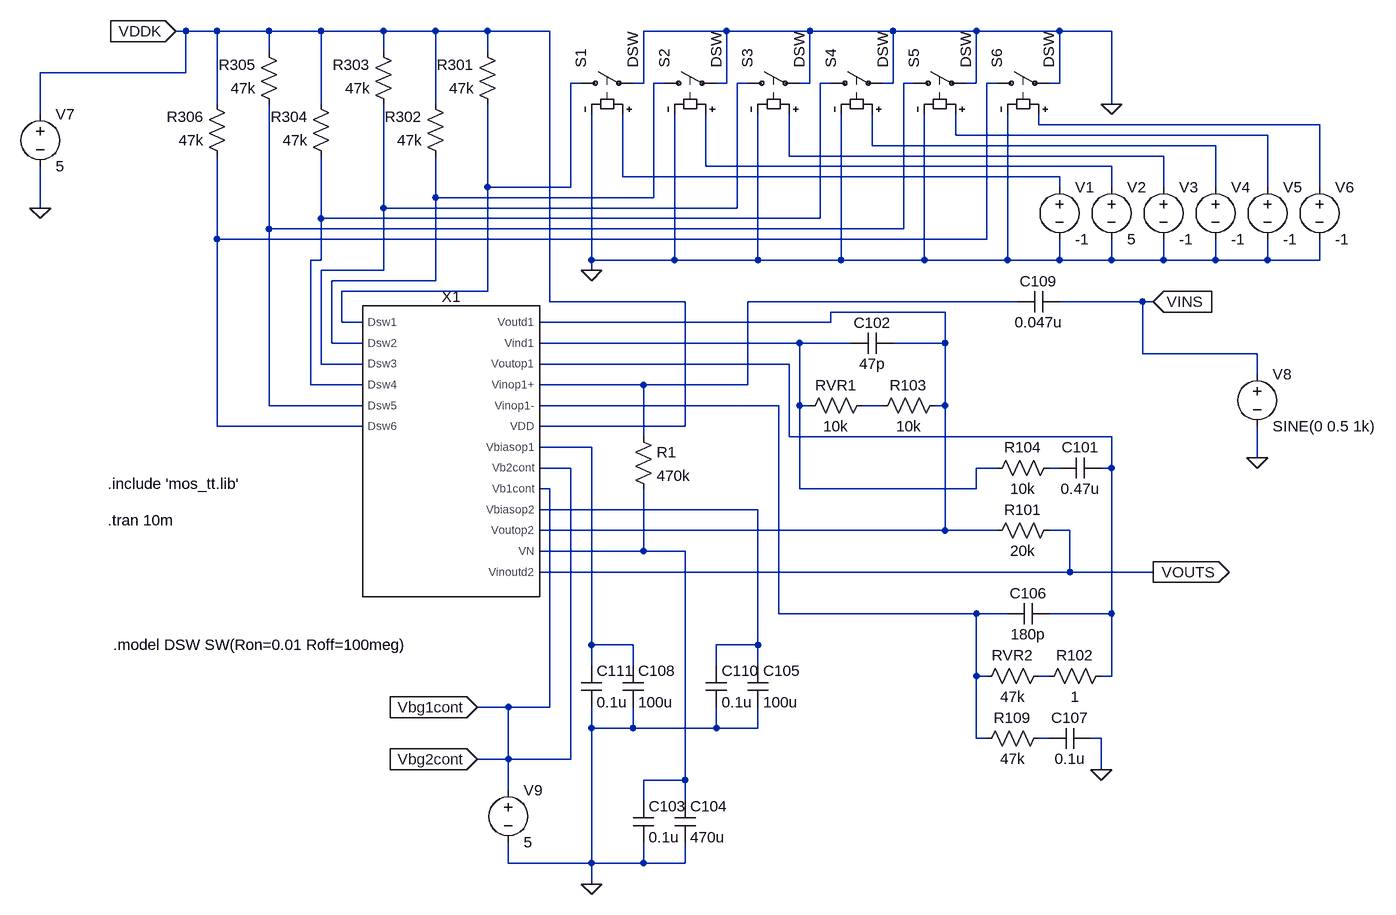
[diagram p0: schematic ishibeESDkibannew.asc]
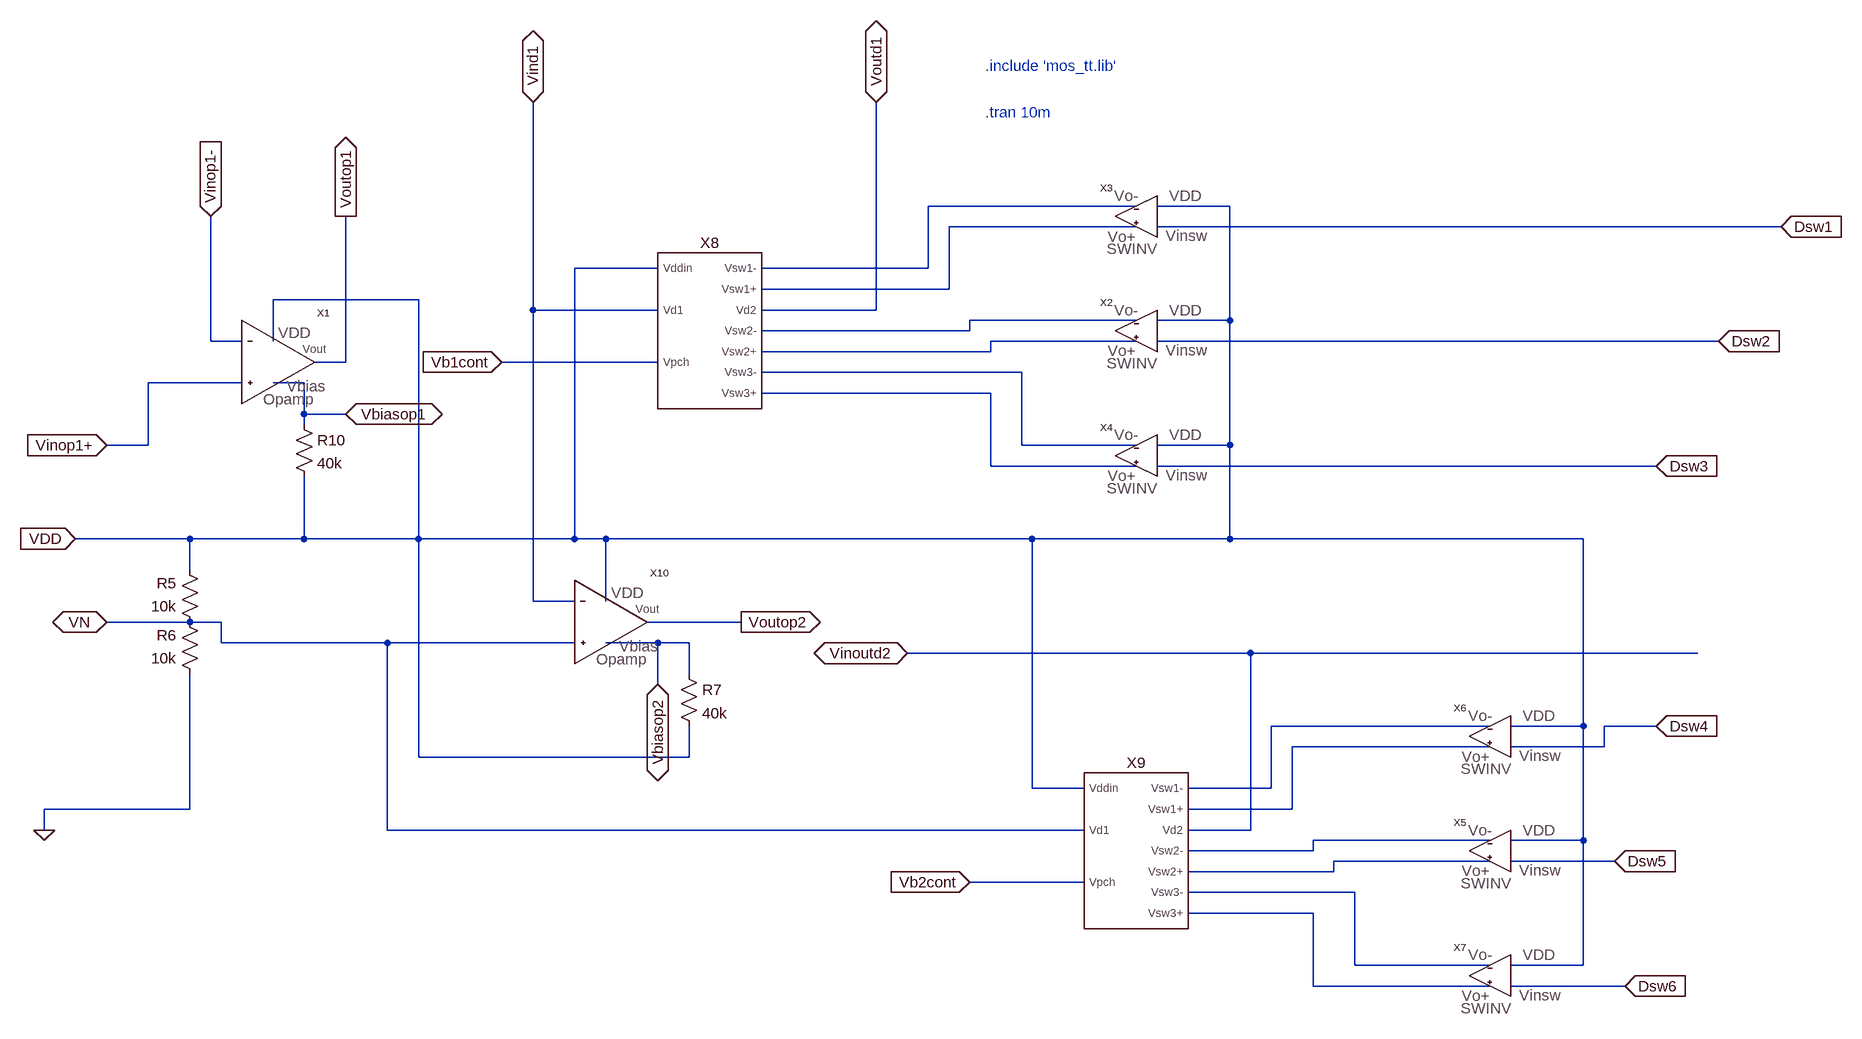
[diagram p1: sub-circuit effectornew.asc]
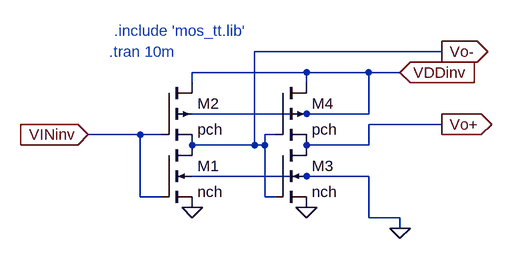
[diagram p2: sub-circuit invsw.asc]
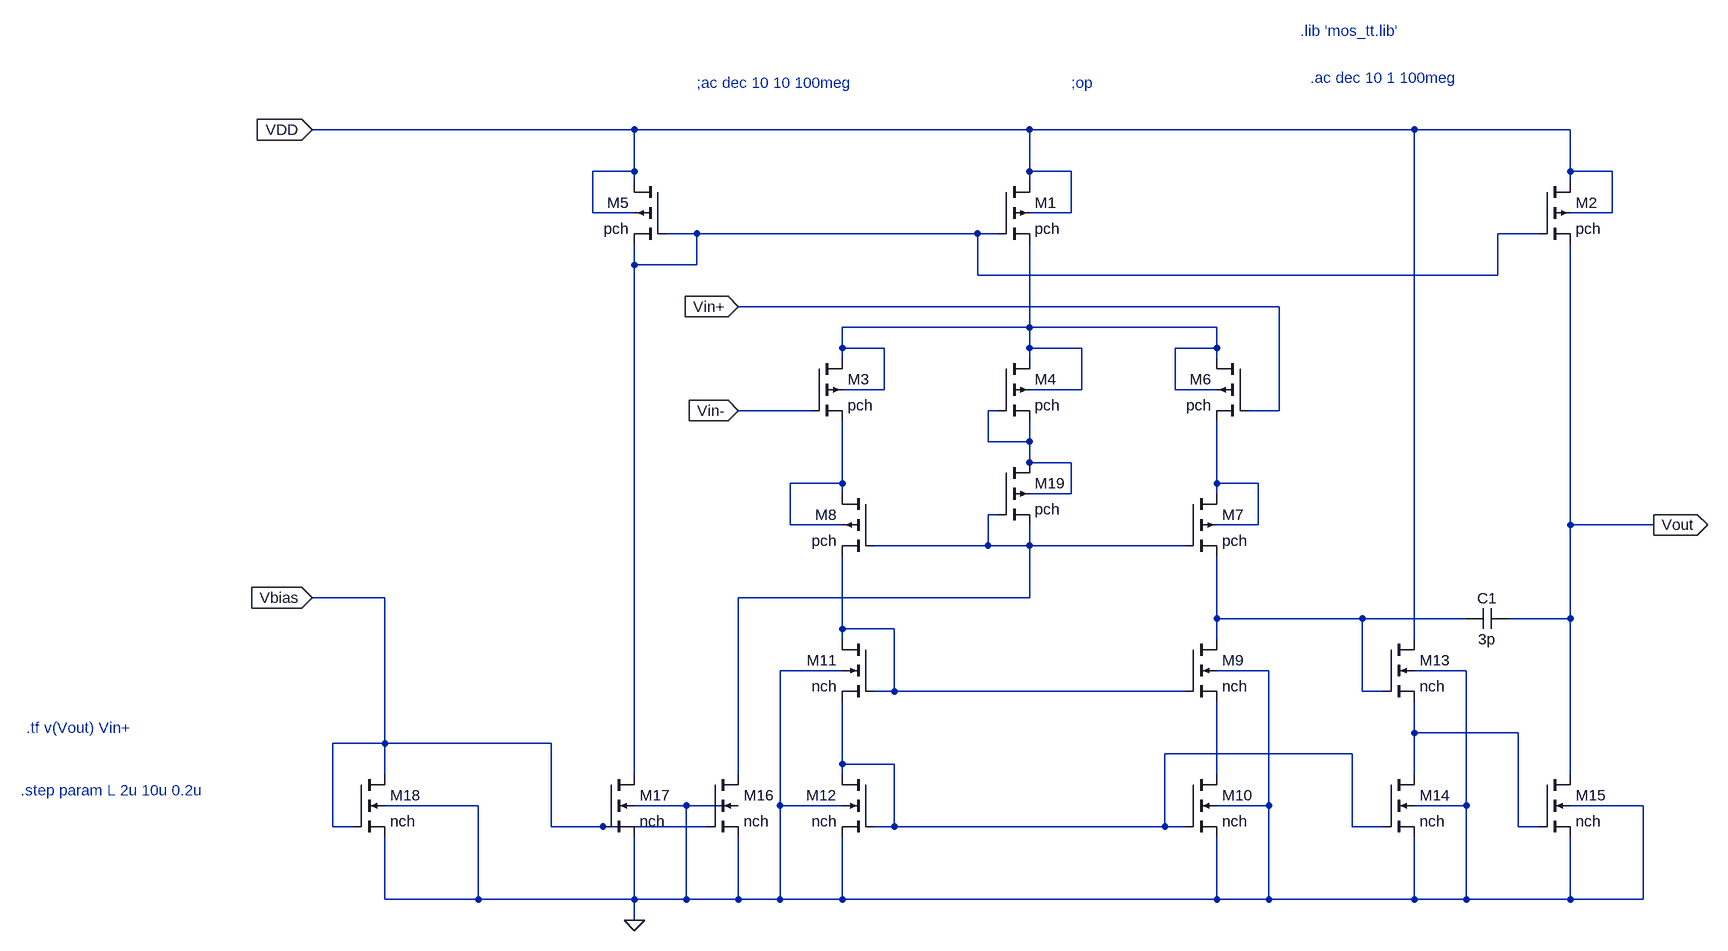
[diagram p3: sub-circuit opamp3u.asc]
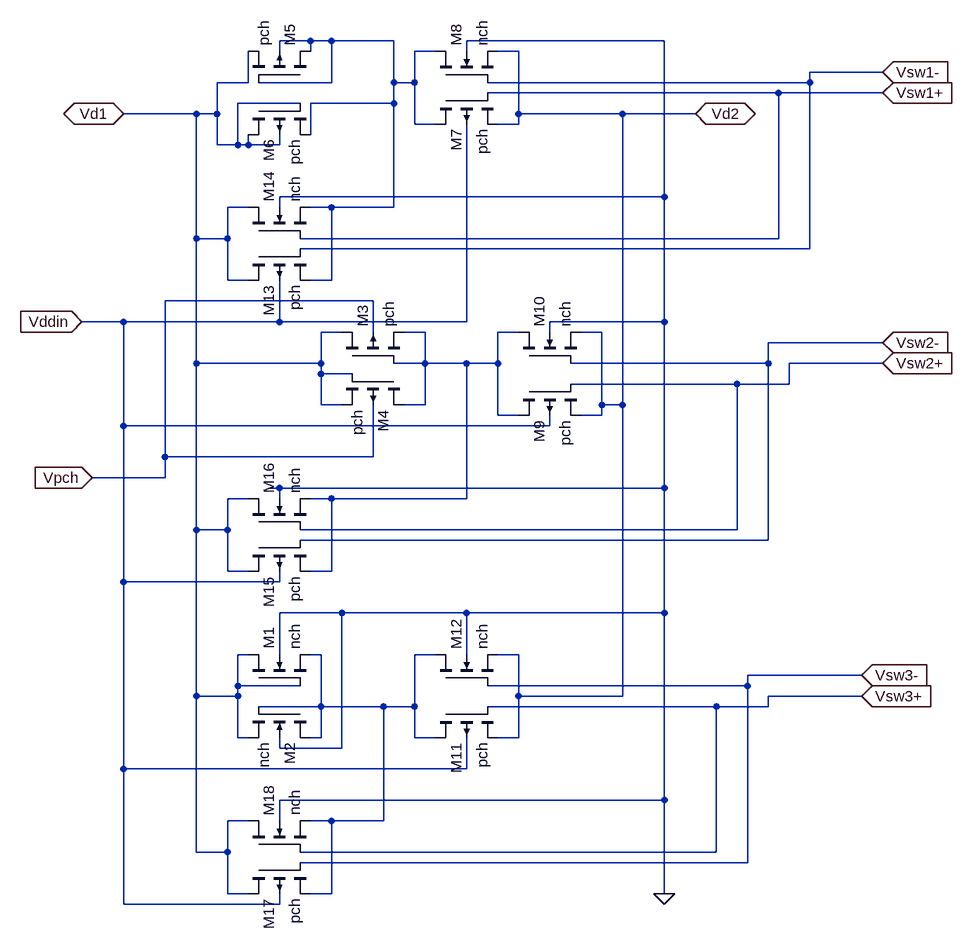
[diagram p4: sub-circuit distotiondevice1esdpchnew.asc]
ishibeESDkibannew.asc, the LTspice schematic file:
Version 4
SHEET 1 1676 900
WIRE -176 -432 -192 -432
WIRE -128 -432 -176 -432
WIRE -48 -432 -128 -432
WIRE 32 -432 -48 -432
WIRE 128 -432 32 -432
WIRE 208 -432 128 -432
WIRE 288 -432 208 -432
WIRE 384 -432 288 -432
WIRE 656 -432 528 -432
WIRE 784 -432 656 -432
WIRE 912 -432 784 -432
WIRE 1040 -432 912 -432
WIRE 1168 -432 1040 -432
WIRE 1248 -432 1168 -432
WIRE -48 -400 -48 -432
WIRE 128 -400 128 -432
WIRE 288 -400 288 -432
WIRE -176 -368 -176 -432
WIRE -176 -368 -400 -368
WIRE 432 -352 416 -352
WIRE 528 -352 528 -432
WIRE 528 -352 512 -352
WIRE 560 -352 544 -352
WIRE 656 -352 656 -432
WIRE 656 -352 640 -352
WIRE 688 -352 672 -352
WIRE 784 -352 784 -432
WIRE 784 -352 768 -352
WIRE 816 -352 800 -352
WIRE 912 -352 912 -432
WIRE 912 -352 896 -352
WIRE 944 -352 928 -352
WIRE 1040 -352 1040 -432
WIRE 1040 -352 1024 -352
WIRE 1072 -352 1056 -352
WIRE 1168 -352 1168 -432
WIRE 1168 -352 1152 -352
WIRE -128 -320 -128 -432
WIRE 32 -320 32 -432
WIRE 208 -320 208 -432
WIRE 1248 -320 1248 -432
WIRE -400 -304 -400 -368
WIRE 1136 -288 1136 -304
WIRE 1568 -288 1136 -288
WIRE 1008 -272 1008 -304
WIRE 1488 -272 1008 -272
WIRE 880 -256 880 -304
WIRE 1408 -256 880 -256
WIRE 752 -240 752 -304
WIRE 1328 -240 752 -240
WIRE 624 -224 624 -304
WIRE 1248 -224 624 -224
WIRE 496 -208 496 -304
WIRE 1168 -208 496 -208
WIRE 288 -192 288 -320
WIRE 416 -192 416 -352
WIRE 416 -192 288 -192
WIRE 1168 -192 1168 -208
WIRE 1248 -192 1248 -224
WIRE 1328 -192 1328 -240
WIRE 1408 -192 1408 -256
WIRE 1488 -192 1488 -272
WIRE 1568 -192 1568 -288
WIRE 208 -176 208 -240
WIRE 544 -176 544 -352
WIRE 544 -176 208 -176
WIRE -400 -160 -400 -224
WIRE 128 -160 128 -320
WIRE 672 -160 672 -352
WIRE 672 -160 128 -160
WIRE 32 -144 32 -240
WIRE 800 -144 800 -352
WIRE 800 -144 32 -144
WIRE -48 -128 -48 -320
WIRE 928 -128 928 -352
WIRE 928 -128 -48 -128
WIRE -128 -112 -128 -240
WIRE 1056 -112 1056 -352
WIRE 1056 -112 -128 -112
WIRE 32 -80 32 -144
WIRE 32 -80 16 -80
WIRE 448 -80 448 -304
WIRE 576 -80 576 -304
WIRE 576 -80 448 -80
WIRE 704 -80 704 -304
WIRE 704 -80 576 -80
WIRE 832 -80 832 -304
WIRE 832 -80 704 -80
WIRE 960 -80 960 -304
WIRE 960 -80 832 -80
WIRE 1088 -80 1088 -304
WIRE 1088 -80 960 -80
WIRE 1168 -80 1168 -112
WIRE 1168 -80 1088 -80
WIRE 1248 -80 1248 -112
WIRE 1248 -80 1168 -80
WIRE 1328 -80 1328 -112
WIRE 1328 -80 1248 -80
WIRE 1408 -80 1408 -112
WIRE 1408 -80 1328 -80
WIRE 1488 -80 1488 -112
WIRE 1488 -80 1408 -80
WIRE 1568 -80 1568 -112
WIRE 1568 -80 1488 -80
WIRE 128 -64 128 -160
WIRE 128 -64 32 -64
WIRE 448 -64 448 -80
WIRE 208 -48 208 -176
WIRE 208 -48 48 -48
WIRE 288 -32 288 -192
WIRE 288 -32 64 -32
WIRE 384 -16 384 -432
WIRE 592 -16 384 -16
WIRE 1104 -16 688 -16
WIRE 1296 -16 1168 -16
WIRE 1312 -16 1296 -16
WIRE 992 0 816 0
WIRE 64 16 64 -32
WIRE 96 16 64 16
WIRE 816 16 816 0
WIRE 816 16 368 16
WIRE 48 48 48 -48
WIRE 96 48 48 48
WIRE 768 48 368 48
WIRE 848 48 768 48
WIRE 992 48 992 0
WIRE 992 48 912 48
WIRE 1296 64 1296 -16
WIRE 1472 64 1296 64
WIRE 32 80 32 -64
WIRE 96 80 32 80
WIRE 752 80 368 80
WIRE 1472 96 1472 64
WIRE 16 112 16 -80
WIRE 96 112 16 112
WIRE 528 112 368 112
WIRE 688 112 688 -16
WIRE 688 112 528 112
WIRE -48 144 -48 -128
WIRE 96 144 -48 144
WIRE 736 144 368 144
WIRE 768 144 768 48
WIRE 784 144 768 144
WIRE 896 144 864 144
WIRE 992 144 992 48
WIRE 992 144 976 144
WIRE -128 176 -128 -112
WIRE 96 176 -128 176
WIRE 592 176 592 -16
WIRE 592 176 368 176
WIRE 528 192 528 112
WIRE 752 192 752 80
WIRE 1248 192 752 192
WIRE 448 208 368 208
WIRE 1472 224 1472 176
WIRE 416 240 368 240
WIRE 1072 240 1040 240
WIRE 1168 240 1152 240
WIRE 1248 240 1248 192
WIRE 1248 240 1232 240
WIRE 384 272 368 272
WIRE 768 272 768 144
WIRE 1040 272 1040 240
WIRE 1040 272 768 272
WIRE 704 304 368 304
WIRE 992 336 992 144
WIRE 992 336 368 336
WIRE 1072 336 992 336
WIRE 1184 336 1152 336
WIRE 528 368 528 272
WIRE 528 368 368 368
WIRE 592 368 528 368
WIRE 1184 400 1184 336
WIRE 1184 400 368 400
WIRE 1312 400 1184 400
WIRE 736 464 736 144
WIRE 1040 464 736 464
WIRE 1088 464 1040 464
WIRE 1248 464 1248 240
WIRE 1248 464 1152 464
WIRE 448 512 448 208
WIRE 512 512 448 512
WIRE 704 512 704 304
WIRE 704 512 640 512
WIRE 448 544 448 512
WIRE 512 544 512 512
WIRE 640 544 640 512
WIRE 704 544 704 512
WIRE 1040 560 1040 464
WIRE 1056 560 1040 560
WIRE 1152 560 1136 560
WIRE 1248 560 1248 464
WIRE 1248 560 1232 560
WIRE 320 608 272 608
WIRE 384 608 384 272
WIRE 384 608 320 608
WIRE 448 640 448 608
WIRE 512 640 512 608
WIRE 512 640 448 640
WIRE 640 640 640 608
WIRE 640 640 512 640
WIRE 704 640 704 608
WIRE 704 640 640 640
WIRE 1040 656 1040 560
WIRE 1056 656 1040 656
WIRE 1152 656 1136 656
WIRE 1232 656 1216 656
WIRE 320 688 320 608
WIRE 320 688 272 688
WIRE 416 688 416 240
WIRE 416 688 320 688
WIRE 1232 704 1232 656
WIRE 592 720 592 368
WIRE 592 720 528 720
WIRE 320 736 320 688
WIRE 528 752 528 720
WIRE 592 752 592 720
WIRE 320 848 320 816
WIRE 448 848 448 640
WIRE 448 848 320 848
WIRE 528 848 528 816
WIRE 528 848 448 848
WIRE 592 848 592 816
WIRE 592 848 528 848
WIRE 448 880 448 848
FLAG 1312 400 VOUTS
IOPIN 1312 400 Out
FLAG 1232 704 0
FLAG 1312 -16 VINS
IOPIN 1312 -16 In
FLAG 448 880 0
FLAG -192 -432 VDDK
IOPIN -192 -432 In
FLAG 448 -64 0
FLAG -400 -160 0
FLAG 1248 -320 0
FLAG 1472 224 0
FLAG 272 608 Vbg1cont
IOPIN 272 608 In
FLAG 272 688 Vbg2cont
IOPIN 272 688 In
SYMBOL cap 848 64 R270
WINDOW 0 32 32 VTop 2
WINDOW 3 0 32 VBottom 2
SYMATTR InstName C102
SYMATTR Value 47p
SYMBOL res 768 160 R270
WINDOW 0 32 56 VTop 2
WINDOW 3 0 56 VBottom 2
SYMATTR InstName RVR1
SYMATTR Value 10k
SYMBOL res 880 160 R270
WINDOW 0 32 56 VTop 2
WINDOW 3 0 56 VBottom 2
SYMATTR InstName R103
SYMATTR Value 10k
SYMBOL res 1056 352 R270
WINDOW 0 32 56 VTop 2
WINDOW 3 0 56 VBottom 2
SYMATTR InstName R101
SYMATTR Value 20k
SYMBOL cap 1088 480 R270
WINDOW 0 32 32 VTop 2
WINDOW 3 0 32 VBottom 2
SYMATTR InstName C106
SYMATTR Value 180p
SYMBOL res 1056 256 R270
WINDOW 0 32 56 VTop 2
WINDOW 3 0 56 VBottom 2
SYMATTR InstName R104
SYMATTR Value 10k
SYMBOL cap 1168 256 R270
WINDOW 0 32 32 VTop 2
WINDOW 3 0 32 VBottom 2
SYMATTR InstName C101
SYMATTR Value 0.47u
SYMBOL res 1136 576 R270
WINDOW 0 32 56 VTop 2
WINDOW 3 0 56 VBottom 2
SYMATTR InstName R102
SYMATTR Value 1
SYMBOL res 1040 576 R270
WINDOW 0 32 56 VTop 2
WINDOW 3 0 56 VBottom 2
SYMATTR InstName RVR2
SYMATTR Value 47k
SYMBOL res 1040 672 R270
WINDOW 0 32 56 VTop 2
WINDOW 3 0 56 VBottom 2
SYMATTR InstName R109
SYMATTR Value 47k
SYMBOL cap 1152 672 R270
WINDOW 0 32 32 VTop 2
WINDOW 3 0 32 VBottom 2
SYMATTR InstName C107
SYMATTR Value 0.1u
SYMBOL cap 1104 0 R270
WINDOW 0 32 32 VTop 2
WINDOW 3 0 32 VBottom 2
SYMATTR InstName C109
SYMATTR Value 0.047u
SYMBOL cap 688 544 R0
SYMATTR InstName C105
SYMATTR Value 100u
SYMBOL cap 624 544 R0
SYMATTR InstName C110
SYMATTR Value 0.1u
SYMBOL cap 496 544 R0
SYMATTR InstName C108
SYMATTR Value 100u
SYMBOL cap 432 544 R0
SYMATTR InstName C111
SYMATTR Value 0.1u
SYMBOL cap 576 752 R0
SYMATTR InstName C104
SYMATTR Value 470u
SYMBOL cap 512 752 R0
SYMATTR InstName C103
SYMATTR Value 0.1u
SYMBOL res 304 -304 R180
WINDOW 0 36 76 Left 2
WINDOW 3 36 40 Left 2
SYMATTR InstName R301
SYMATTR Value 47k
SYMBOL res 224 -224 R180
WINDOW 0 36 76 Left 2
WINDOW 3 36 40 Left 2
SYMATTR InstName R302
SYMATTR Value 47k
SYMBOL res 144 -304 R180
WINDOW 0 36 76 Left 2
WINDOW 3 36 40 Left 2
SYMATTR InstName R303
SYMATTR Value 47k
SYMBOL res 48 -224 R180
WINDOW 0 36 76 Left 2
WINDOW 3 36 40 Left 2
SYMATTR InstName R304
SYMATTR Value 47k
SYMBOL res -32 -304 R180
WINDOW 0 36 76 Left 2
WINDOW 3 36 40 Left 2
SYMATTR InstName R305
SYMATTR Value 47k
SYMBOL res -112 -224 R180
WINDOW 0 36 76 Left 2
WINDOW 3 36 40 Left 2
SYMATTR InstName R306
SYMATTR Value 47k
SYMBOL sw 416 -352 R270
SYMATTR InstName S1
SYMATTR Value DSW
SYMBOL sw 544 -352 R270
SYMATTR InstName S2
SYMATTR Value DSW
SYMBOL sw 672 -352 R270
SYMATTR InstName S3
SYMATTR Value DSW
SYMBOL sw 800 -352 R270
SYMATTR InstName S4
SYMATTR Value DSW
SYMBOL sw 928 -352 R270
SYMATTR InstName S5
SYMATTR Value DSW
SYMBOL sw 1056 -352 R270
SYMATTR InstName S6
SYMATTR Value DSW
SYMBOL voltage 1168 -208 R0
WINDOW 123 0 0 Left 2
WINDOW 39 0 0 Left 2
SYMATTR InstName V1
SYMATTR Value -1
SYMBOL voltage 1248 -208 R0
WINDOW 123 0 0 Left 2
WINDOW 39 0 0 Left 2
SYMATTR InstName V2
SYMATTR Value 5
SYMBOL voltage 1328 -208 R0
WINDOW 123 0 0 Left 2
WINDOW 39 0 0 Left 2
SYMATTR InstName V3
SYMATTR Value -1
SYMBOL voltage 1408 -208 R0
WINDOW 123 0 0 Left 2
WINDOW 39 0 0 Left 2
SYMATTR InstName V4
SYMATTR Value -1
SYMBOL voltage 1488 -208 R0
WINDOW 123 0 0 Left 2
WINDOW 39 0 0 Left 2
SYMATTR InstName V5
SYMATTR Value -1
SYMBOL voltage 1568 -208 R0
WINDOW 123 0 0 Left 2
WINDOW 39 0 0 Left 2
SYMATTR InstName V6
SYMATTR Value -1
SYMBOL voltage -400 -320 R0
WINDOW 123 0 0 Left 2
WINDOW 39 0 0 Left 2
SYMATTR InstName V7
SYMATTR Value 5
SYMBOL voltage 1472 80 R0
WINDOW 123 0 0 Left 2
WINDOW 39 0 0 Left 2
SYMATTR InstName V8
SYMATTR Value SINE(0 0.5 1k)
SYMBOL res 512 176 R0
SYMATTR InstName R1
SYMATTR Value 470k
SYMBOL voltage 320 720 R0
WINDOW 123 0 0 Left 2
WINDOW 39 0 0 Left 2
SYMATTR InstName V9
SYMATTR Value 5
SYMBOL effectornew 224 176 R0
SYMATTR InstName X1
TEXT -296 264 Left 2 !.include 'mos_tt.lib'
TEXT -296 320 Left 2 !.tran 10m
TEXT -288 512 Left 2 !.model DSW SW(Ron=0.01 Roff=100meg)

effectornew.asc, the sub-circuit schematic file:
Version 4
SHEET 1 2252 1512
WIRE 1024 128 704 128
WIRE 1168 128 1056 128
WIRE 1024 160 736 160
WIRE 2016 160 1056 160
WIRE 288 224 160 224
WIRE 704 224 704 128
WIRE 704 224 448 224
WIRE 736 256 736 160
WIRE 736 256 448 256
WIRE -80 272 -304 272
WIRE 96 288 96 -32
WIRE 288 288 96 288
WIRE 624 288 624 -32
WIRE 624 288 448 288
WIRE 1024 304 768 304
WIRE 1168 304 1168 128
WIRE 1168 304 1056 304
WIRE 768 320 768 304
WIRE 768 320 448 320
WIRE -400 336 -400 144
WIRE -352 336 -400 336
WIRE -304 336 -304 272
WIRE 1024 336 800 336
WIRE 1920 336 1056 336
WIRE 800 352 800 336
WIRE 800 352 448 352
WIRE -192 368 -192 144
WIRE -192 368 -240 368
WIRE 288 368 48 368
WIRE 848 384 448 384
WIRE -352 400 -496 400
WIRE -256 400 -304 400
WIRE 800 416 448 416
WIRE -256 448 -256 400
WIRE -192 448 -256 448
WIRE -256 464 -256 448
WIRE -496 496 -496 400
WIRE -496 496 -560 496
WIRE 848 496 848 384
WIRE 1024 496 848 496
WIRE 1168 496 1168 304
WIRE 1168 496 1056 496
WIRE 800 528 800 416
WIRE 1024 528 800 528
WIRE 1824 528 1056 528
WIRE -432 640 -608 640
WIRE -256 640 -256 544
WIRE -256 640 -432 640
WIRE -80 640 -80 272
WIRE -80 640 -256 640
WIRE 160 640 160 224
WIRE 160 640 -80 640
WIRE 208 640 160 640
WIRE 864 640 208 640
WIRE 1168 640 1168 496
WIRE 1168 640 864 640
WIRE 1712 640 1168 640
WIRE -432 688 -432 640
WIRE 96 736 96 288
WIRE 160 736 96 736
WIRE 208 736 208 640
WIRE -432 768 -560 768
WIRE -384 768 -432 768
WIRE 416 768 272 768
WIRE -384 800 -384 768
WIRE -128 800 -384 800
WIRE 160 800 -128 800
WIRE 288 800 208 800
WIRE 336 800 288 800
WIRE 1200 816 672 816
WIRE 1888 816 1200 816
WIRE 336 848 336 800
WIRE 288 864 288 800
WIRE 1568 928 1232 928
WIRE 1712 928 1712 640
WIRE 1712 928 1600 928
WIRE 1824 928 1744 928
WIRE 1568 960 1264 960
WIRE 1744 960 1744 928
WIRE 1744 960 1600 960
WIRE -80 976 -80 640
WIRE 336 976 336 928
WIRE 336 976 -80 976
WIRE 864 1024 864 640
WIRE 944 1024 864 1024
WIRE 1232 1024 1232 928
WIRE 1232 1024 1104 1024
WIRE -432 1056 -432 848
WIRE -432 1056 -656 1056
WIRE 1264 1056 1264 960
WIRE 1264 1056 1104 1056
WIRE -656 1088 -656 1056
WIRE -128 1088 -128 800
WIRE 944 1088 -128 1088
WIRE 1200 1088 1200 816
WIRE 1200 1088 1104 1088
WIRE 1568 1104 1296 1104
WIRE 1712 1104 1712 928
WIRE 1712 1104 1600 1104
WIRE 1296 1120 1296 1104
WIRE 1296 1120 1104 1120
WIRE 1568 1136 1328 1136
WIRE 1760 1136 1600 1136
WIRE 1328 1152 1328 1136
WIRE 1328 1152 1104 1152
WIRE 944 1168 768 1168
WIRE 1360 1184 1104 1184
WIRE 1296 1216 1104 1216
WIRE 1360 1296 1360 1184
WIRE 1568 1296 1360 1296
WIRE 1712 1296 1712 1104
WIRE 1712 1296 1600 1296
WIRE 1296 1328 1296 1216
WIRE 1568 1328 1296 1328
WIRE 1776 1328 1600 1328
FLAG -656 1088 0
FLAG -560 768 VN
IOPIN -560 768 BiDir
FLAG 288 864 Vbiasop2
IOPIN 288 864 BiDir
FLAG 672 816 Vinoutd2
IOPIN 672 816 BiDir
FLAG 1776 1328 Dsw6
IOPIN 1776 1328 In
FLAG 1760 1136 Dsw5
IOPIN 1760 1136 In
FLAG 1824 928 Dsw4
IOPIN 1824 928 In
FLAG 1824 528 Dsw3
IOPIN 1824 528 In
FLAG 1920 336 Dsw2
IOPIN 1920 336 In
FLAG 2016 160 Dsw1
IOPIN 2016 160 In
FLAG 416 768 Voutop2
IOPIN 416 768 Out
FLAG 624 -32 Voutd1
IOPIN 624 -32 BiDir
FLAG 96 -32 Vind1
IOPIN 96 -32 BiDir
FLAG 768 1168 Vb2cont
IOPIN 768 1168 In
FLAG 48 368 Vb1cont
IOPIN 48 368 In
FLAG -192 144 Voutop1
IOPIN -192 144 Out
FLAG -192 448 Vbiasop1
IOPIN -192 448 BiDir
FLAG -560 496 Vinop1+
IOPIN -560 496 In
FLAG -608 640 VDD
IOPIN -608 640 In
FLAG -400 144 Vinop1-
IOPIN -400 144 In
SYMBOL res -416 784 R180
WINDOW 0 36 76 Left 2
WINDOW 3 36 40 Left 2
SYMATTR InstName R5
SYMATTR Value 10k
SYMBOL res -416 864 R180
WINDOW 0 36 76 Left 2
WINDOW 3 36 40 Left 2
SYMATTR InstName R6
SYMATTR Value 10k
SYMBOL INVSW 1024 320 M0
SYMATTR InstName X2
SYMBOL INVSW 1024 144 M0
SYMATTR InstName X3
SYMBOL INVSW 1024 512 M0
SYMATTR InstName X4
SYMBOL res 320 832 R0
SYMATTR InstName R7
SYMATTR Value 40k
SYMBOL INVSW 1568 1120 M0
SYMATTR InstName X5
SYMBOL INVSW 1568 944 M0
SYMATTR InstName X6
SYMBOL INVSW 1568 1312 M0
SYMATTR InstName X7
SYMBOL res -272 448 R0
SYMATTR InstName R10
SYMATTR Value 40k
SYMBOL Opamp3u -272 368 R0
SYMATTR InstName X1
SYMBOL Opamp3u 240 768 R0
SYMATTR InstName X10
SYMBOL Distotiondevice1ESDpchnew 368 320 R0
SYMATTR InstName X8
SYMBOL Distotiondevice1ESDpchnew 1024 1120 R0
SYMATTR InstName X9
TEXT 792 -16 Left 2 ;.tran 10m
TEXT 792 -88 Left 2 ;.include 'mos_tt.lib'

invsw.asc, the sub-circuit schematic file:
Version 4
SHEET 1 880 680
WIRE 544 32 256 32
WIRE 336 64 160 64
WIRE 432 64 336 64
WIRE 480 64 432 64
WIRE 160 80 160 64
WIRE 336 80 336 64
WIRE 336 128 160 128
WIRE 432 128 432 64
WIRE 432 128 336 128
WIRE 544 144 432 144
WIRE 80 160 0 160
WIRE 112 160 80 160
WIRE 288 160 272 160
WIRE 256 176 256 32
WIRE 256 176 160 176
WIRE 272 176 272 160
WIRE 272 176 256 176
WIRE 432 176 432 144
WIRE 432 176 336 176
WIRE 336 224 160 224
WIRE 432 224 336 224
WIRE 80 256 80 160
WIRE 112 256 80 256
WIRE 272 256 272 176
WIRE 288 256 272 256
WIRE 432 288 432 224
WIRE 480 288 432 288
WIRE 480 304 480 288
FLAG 480 304 0
FLAG 160 272 0
FLAG 336 272 0
FLAG 544 144 Vo+
IOPIN 544 144 Out
FLAG 544 32 Vo-
IOPIN 544 32 Out
FLAG 480 64 VDDinv
IOPIN 480 64 In
FLAG 0 160 VINinv
IOPIN 0 160 In
SYMBOL nmos4 112 176 R0
SYMATTR InstName M1
SYMATTR Value2 l=2u w=6u ad=4.2e-11 as=4.2e-11 pd=20e-6 ps=20e-6
SYMATTR Value nch
SYMBOL pmos4 112 80 R0
SYMATTR InstName M2
SYMATTR Value2 l=2u w=10u ad=7e-11 as=7e-11 pd=24e-6 ps=24e-6
SYMATTR Value pch
SYMBOL nmos4 288 176 R0
SYMATTR InstName M3
SYMATTR Value2 l=2u w=12u ad=8.4e-11 as=8.4e-11 pd=26e-6 ps=26e-6
SYMATTR Value nch
SYMBOL pmos4 288 80 R0
SYMATTR InstName M4
SYMATTR Value2 l=2u w=20u ad=1.4e-10 as=1.4e-10 pd=34e-6 ps=34e-6
SYMATTR Value pch
TEXT 32 32 Left 2 ;.tran 10m
TEXT 40 0 Left 2 ;.include 'mos_tt.lib'

opamp3u.asc, the sub-circuit schematic file:
Version 4
SHEET 1 1400 868
WIRE -288 -368 -784 -368
WIRE 320 -368 -288 -368
WIRE 912 -368 320 -368
WIRE 1152 -368 912 -368
WIRE -288 -304 -288 -368
WIRE -288 -304 -352 -304
WIRE 320 -304 320 -368
WIRE 384 -304 320 -304
WIRE 1152 -304 1152 -368
WIRE 1216 -304 1152 -304
WIRE -288 -288 -288 -304
WIRE 320 -288 320 -304
WIRE 1152 -288 1152 -304
WIRE -352 -240 -352 -304
WIRE -288 -240 -352 -240
WIRE 384 -240 384 -304
WIRE 384 -240 320 -240
WIRE 1216 -240 1216 -304
WIRE 1216 -240 1152 -240
WIRE -192 -208 -240 -208
WIRE 240 -208 -192 -208
WIRE 272 -208 240 -208
WIRE 1104 -208 1040 -208
WIRE -288 -160 -288 -192
WIRE -192 -160 -192 -208
WIRE -192 -160 -288 -160
WIRE 240 -144 240 -208
WIRE 1040 -144 1040 -208
WIRE 1040 -144 240 -144
WIRE 704 -96 -128 -96
WIRE 320 -64 320 -192
WIRE 320 -64 32 -64
WIRE 608 -64 320 -64
WIRE 32 -32 32 -64
WIRE 96 -32 32 -32
WIRE 320 -32 320 -64
WIRE 400 -32 320 -32
WIRE 608 -32 608 -64
WIRE 608 -32 544 -32
WIRE 32 -16 32 -32
WIRE 320 -16 320 -32
WIRE 608 -16 608 -32
WIRE 96 32 96 -32
WIRE 96 32 32 32
WIRE 400 32 400 -32
WIRE 400 32 320 32
WIRE 544 32 544 -32
WIRE 608 32 544 32
WIRE -16 64 -128 64
WIRE 272 64 256 64
WIRE 704 64 704 -96
WIRE 704 64 656 64
WIRE 256 112 256 64
WIRE 320 112 320 80
WIRE 320 112 256 112
WIRE 320 144 320 112
WIRE 384 144 320 144
WIRE 32 176 32 80
WIRE 32 176 -48 176
WIRE 608 176 608 80
WIRE 672 176 608 176
WIRE 32 192 32 176
WIRE 384 192 384 144
WIRE 384 192 320 192
WIRE 608 192 608 176
WIRE 272 224 256 224
WIRE -48 240 -48 176
WIRE 32 240 -48 240
WIRE 672 240 672 176
WIRE 672 240 608 240
WIRE 1152 240 1152 -192
WIRE 1280 240 1152 240
WIRE 256 272 256 224
WIRE 256 272 80 272
WIRE 320 272 320 240
WIRE 320 272 256 272
WIRE 560 272 320 272
WIRE -672 352 -784 352
WIRE 320 352 320 272
WIRE 320 352 -128 352
WIRE 608 384 608 288
WIRE 832 384 608 384
WIRE 992 384 832 384
WIRE 1152 384 1152 240
WIRE 1152 384 1056 384
WIRE 32 400 32 288
WIRE 112 400 32 400
WIRE 32 416 32 400
WIRE 608 416 608 384
WIRE 912 416 912 -368
WIRE 32 464 -64 464
WIRE 688 464 608 464
WIRE 992 464 912 464
WIRE 112 496 112 400
WIRE 112 496 80 496
WIRE 560 496 112 496
WIRE 832 496 832 384
WIRE 864 496 832 496
WIRE 912 560 912 512
WIRE 1072 560 912 560
WIRE -672 576 -672 352
WIRE -672 576 -752 576
WIRE -416 576 -672 576
WIRE 816 592 528 592
WIRE 32 608 32 512
WIRE 112 608 32 608
WIRE -672 624 -672 576
WIRE -288 624 -288 -160
WIRE -128 624 -128 352
WIRE 32 624 32 608
WIRE 608 624 608 512
WIRE 912 624 912 560
WIRE 1152 624 1152 384
WIRE -528 672 -672 672
WIRE -208 672 -288 672
WIRE -128 672 -208 672
WIRE -64 672 -64 464
WIRE 32 672 -64 672
WIRE 688 672 688 464
WIRE 688 672 608 672
WIRE 992 672 992 464
WIRE 992 672 912 672
WIRE 1264 672 1152 672
WIRE -752 704 -752 576
WIRE -720 704 -752 704
WIRE -416 704 -416 576
WIRE -336 704 -416 704
WIRE -176 704 -336 704
WIRE 112 704 112 608
WIRE 112 704 80 704
WIRE 528 704 528 592
WIRE 528 704 112 704
WIRE 560 704 528 704
WIRE 816 704 816 592
WIRE 864 704 816 704
WIRE 1072 704 1072 560
WIRE 1104 704 1072 704
WIRE -672 816 -672 720
WIRE -528 816 -528 672
WIRE -528 816 -672 816
WIRE -288 816 -288 720
WIRE -288 816 -528 816
WIRE -208 816 -208 672
WIRE -208 816 -288 816
WIRE -128 816 -128 720
WIRE -128 816 -208 816
WIRE -64 816 -64 672
WIRE -64 816 -128 816
WIRE 32 816 32 720
WIRE 32 816 -64 816
WIRE 608 816 608 720
WIRE 608 816 32 816
WIRE 688 816 688 672
WIRE 688 816 608 816
WIRE 912 816 912 720
WIRE 912 816 688 816
WIRE 992 816 992 672
WIRE 992 816 912 816
WIRE 1152 816 1152 720
WIRE 1152 816 992 816
WIRE 1264 816 1264 672
WIRE 1264 816 1152 816
WIRE -288 848 -288 816
FLAG -288 848 0
FLAG -128 64 Vin-
IOPIN -128 64 In
FLAG -128 -96 Vin+
IOPIN -128 -96 In
FLAG -784 -368 VDD
IOPIN -784 -368 In
FLAG 1280 240 Vout
IOPIN 1280 240 Out
FLAG -784 352 Vbias
IOPIN -784 352 In
SYMBOL pmos4 272 -288 R0
SYMATTR InstName M1
SYMATTR Value pch
SYMATTR Value2 l=3u w=150u ad=1.05e-9 as=1.05e-9 pd=164e-6 ps=164e-6
SYMBOL pmos4 1104 -288 R0
SYMATTR InstName M2
SYMATTR Value pch
SYMATTR Value2 l=3u w=150u ad=1.05e-9 as=1.05e-9 pd=164e-6 ps=164e-6 m=2
SYMBOL pmos4 -16 -16 R0
SYMATTR InstName M3
SYMATTR Value pch
SYMATTR Value2 l=3u w=75u ad=5.25e-10 as=5.25e-10 pd=89e-6 ps=89e-6
SYMBOL pmos4 272 -16 R0
SYMATTR InstName M4
SYMATTR Value pch
SYMATTR Value2 l=2u w=75u ad=5.25e-10 as=5.25e-10 pd=89e-6 ps=89e-6
SYMBOL pmos4 -240 -288 M0
SYMATTR InstName M5
SYMATTR Value pch
SYMATTR Value2 l=3u w=150u ad=1.05e-9 as=1.05e-9 pd=164e-6 ps=164e-6
SYMBOL pmos4 656 -16 M0
SYMATTR InstName M6
SYMATTR Value pch
SYMATTR Value2 l=3u w=75u ad=5.25e-10 as=5.25e-10 pd=89e-6 ps=89e-6
SYMBOL pmos4 560 192 R0
SYMATTR InstName M7
SYMATTR Value pch
SYMATTR Value2 l=4u w=75u ad=5.25e-10 as=5.25e-10 pd=89e-6 ps=89e-6
SYMBOL pmos4 80 192 M0
SYMATTR InstName M8
SYMATTR Value pch
SYMATTR Value2 l=4u w=75u ad=5.25e-10 as=5.25e-10 pd=89e-6 ps=89e-6
SYMBOL nmos4 560 416 R0
SYMATTR InstName M9
SYMATTR Value nch
SYMATTR Value2 l=3u w=50u ad=3.5e-10 as=3.5e-10 pd=64e-6 ps=64e-6
SYMBOL nmos4 560 624 R0
SYMATTR InstName M10
SYMATTR Value nch
SYMATTR Value2 l=3u w=50u ad=3.5e-10 as=3.5e-10 pd=64e-6 ps=64e-6
SYMBOL nmos4 80 416 M0
SYMATTR InstName M11
SYMATTR Value nch
SYMATTR Value2 l=3u w=50u ad=3.5e-10 as=3.5e-10 pd=64e-6 ps=64e-6
SYMBOL nmos4 80 624 M0
SYMATTR InstName M12
SYMATTR Value nch
SYMATTR Value2 l=3u w=50u ad=3.5e-10 as=3.5e-10 pd=64e-6 ps=64e-6
SYMBOL nmos4 864 416 R0
SYMATTR InstName M13
SYMATTR Value nch
SYMATTR Value2 l=3u w=50u ad=3.5e-10 as=3.5e-10 pd=64e-6 ps=64e-6
SYMBOL nmos4 864 624 R0
SYMATTR InstName M14
SYMATTR Value nch
SYMATTR Value2 l=3u w=50u ad=3.5e-10 as=3.5e-10 pd=64e-6 ps=64e-6
SYMBOL nmos4 1104 624 R0
SYMATTR InstName M15
SYMATTR Value nch
SYMATTR Value2 l=3u w=300u ad=2.1e-9 as=2.1e-9 pd=314e-6 ps=314e-6
SYMBOL cap 992 400 R270
WINDOW 0 32 32 VTop 2
WINDOW 3 0 32 VBottom 2
SYMATTR InstName C1
SYMATTR Value 3p
SYMBOL nmos4 -176 624 R0
SYMATTR InstName M16
SYMATTR Value nch
SYMATTR Value2 l=3u w=50u ad=3.5e-10 as=3.5e-10 pd=64e-6 ps=64e-6
SYMBOL nmos4 -336 624 R0
SYMATTR InstName M17
SYMATTR Value nch
SYMATTR Value2 l=3u w=100u ad=7e-10 as=7e-10 pd=114e-6 ps=114e-6
SYMBOL nmos4 -720 624 R0
SYMATTR InstName M18
SYMATTR Value nch
SYMATTR Value2 l=3u w=100u ad=7e-10 as=7e-10 pd=114e-6 ps=114e-6
SYMBOL pmos4 272 144 R0
SYMATTR InstName M19
SYMATTR Value2 l=2u w=75u ad=5.25e-10 as=5.25e-10 pd=89e-6 ps=89e-6
SYMATTR Value pch
TEXT 752 -448 Left 2 ;.ac dec 10 1 100meg
TEXT 736 -520 Left 2 ;.lib 'mos_tt.lib'
TEXT 384 -440 Left 2 ;;op
TEXT -192 -440 Left 2 ;;ac dec 10 10 100meg
TEXT -1224 552 Left 2 ;.tf v(Vout) Vin+
TEXT -1232 648 Left 2 ;.step param L 2u 10u 0.2u

distotiondevice1esdpchnew.asc, the sub-circuit schematic file:
Version 4
SHEET 1 2252 1512
WIRE 144 -160 96 -160
WIRE 176 -160 144 -160
WIRE 272 -160 176 -160
WIRE 688 -160 384 -160
WIRE 96 -144 96 -160
WIRE 144 -144 144 -160
WIRE 336 -144 304 -144
WIRE 384 -144 384 -160
WIRE 464 -144 432 -144
WIRE 1024 -112 912 -112
WIRE 48 -96 48 -144
WIRE 48 -96 0 -96
WIRE 176 -96 176 -160
WIRE 176 -96 64 -96
WIRE 272 -96 272 -160
WIRE 304 -96 304 -144
WIRE 304 -96 272 -96
WIRE 912 -96 912 -112
WIRE 912 -96 416 -96
WIRE 864 -80 416 -80
WIRE 1024 -80 864 -80
WIRE 128 -64 32 -64
WIRE 272 -64 272 -96
WIRE 272 -64 144 -64
WIRE -32 -48 -144 -48
WIRE 0 -48 0 -96
WIRE 0 -48 -32 -48
WIRE 464 -48 464 -144
WIRE 624 -48 464 -48
WIRE 736 -48 624 -48
WIRE 304 -32 304 -96
WIRE 336 -32 304 -32
WIRE 464 -32 464 -48
WIRE 464 -32 432 -32
WIRE 144 -16 144 -64
WIRE 0 0 0 -48
WIRE 32 0 32 -64
WIRE 32 0 0 0
WIRE 48 0 48 -16
WIRE 48 0 32 0
WIRE 96 0 96 -16
WIRE 96 0 48 0
WIRE 688 80 688 -160
WIRE 688 80 96 80
WIRE 48 96 16 96
WIRE 96 96 96 80
WIRE 176 96 144 96
WIRE 272 96 272 -64
WIRE 272 96 176 96
WIRE -32 144 -32 -48
WIRE 16 144 16 96
WIRE 16 144 -32 144
WIRE 864 144 864 -80
WIRE 864 144 128 144
WIRE 912 160 912 -96
WIRE 912 160 128 160
WIRE 16 208 16 144
WIRE 48 208 16 208
WIRE 176 208 176 96
WIRE 176 208 144 208
WIRE 240 240 -80 240
WIRE -144 272 -208 272
WIRE 96 272 96 208
WIRE 96 272 -144 272
WIRE 384 272 384 -32
WIRE 384 272 96 272
WIRE 688 272 688 80
WIRE 688 272 512 272
WIRE 192 288 160 288
WIRE 240 288 240 240
WIRE 320 288 288 288
WIRE 464 288 432 288
WIRE 512 288 512 272
WIRE 592 288 560 288
WIRE 1024 304 848 304
WIRE -32 336 -32 144
WIRE 160 336 160 288
WIRE 160 336 -32 336
WIRE 320 336 320 288
WIRE 320 336 272 336
WIRE 384 336 320 336
WIRE 432 336 432 288
WIRE 432 336 384 336
WIRE 848 336 848 304
WIRE 848 336 544 336
WIRE 1024 336 880 336
WIRE 160 352 160 336
WIRE 208 352 160 352
WIRE 800 368 544 368
WIRE 880 368 880 336
WIRE 880 368 800 368
WIRE 160 400 160 352
WIRE 192 400 160 400
WIRE 320 400 320 336
WIRE 320 400 288 400
WIRE 592 400 592 288
WIRE 624 400 624 -48
WIRE 624 400 592 400
WIRE 432 416 432 336
WIRE 464 416 432 416
WIRE 592 416 592 400
WIRE 592 416 560 416
WIRE -144 432 -144 272
WIRE 512 432 512 416
WIRE 512 432 -144 432
WIRE -80 480 -80 240
WIRE 240 480 240 400
WIRE 240 480 -80 480
WIRE -80 512 -80 480
WIRE -80 512 -192 512
WIRE 96 528 80 528
WIRE 688 528 688 272
WIRE 688 528 96 528
WIRE 48 544 16 544
WIRE 96 544 96 528
WIRE 176 544 144 544
WIRE 384 544 384 336
WIRE 384 544 176 544
WIRE -32 592 -32 336
WIRE 16 592 16 544
WIRE 16 592 -32 592
WIRE 800 592 800 368
WIRE 800 592 128 592
WIRE 848 608 848 336
WIRE 848 608 128 608
WIRE 16 656 16 592
WIRE 48 656 16 656
WIRE 176 656 176 544
WIRE 176 656 144 656
WIRE -144 672 -144 432
WIRE 96 672 96 656
WIRE 96 672 -144 672
WIRE 192 720 96 720
WIRE 384 720 192 720
WIRE 688 720 688 528
WIRE 688 720 384 720
WIRE 48 784 32 784
WIRE 96 784 96 720
WIRE 160 784 144 784
WIRE 336 784 304 784
WIRE 384 784 384 720
WIRE 464 784 432 784
WIRE 992 816 816 816
WIRE 32 832 32 784
WIRE 128 832 32 832
WIRE 816 832 816 816
WIRE 816 832 416 832
WIRE -32 848 -32 592
WIRE 32 848 32 832
WIRE 32 848 -32 848
WIRE 464 848 464 784
WIRE 624 848 624 400
WIRE 624 848 464 848
WIRE 992 848 848 848
WIRE 160 864 160 784
WIRE 160 864 64 864
WIRE 256 864 160 864
WIRE 304 864 304 784
WIRE 304 864 256 864
WIRE 768 864 416 864
WIRE 848 864 848 848
WIRE 848 864 768 864
WIRE 32 912 32 848
WIRE 48 912 32 912
WIRE 160 912 160 864
WIRE 160 912 144 912
WIRE 304 912 304 864
WIRE 336 912 304 912
WIRE 464 912 464 848
WIRE 464 912 432 912
WIRE 96 928 96 912
WIRE 192 928 192 720
WIRE 192 928 96 928
WIRE -144 960 -144 672
WIRE 384 960 384 912
WIRE 384 960 -144 960
WIRE 688 1008 688 720
WIRE 688 1008 96 1008
WIRE 48 1040 16 1040
WIRE 96 1040 96 1008
WIRE 176 1040 144 1040
WIRE 256 1040 256 864
WIRE 256 1040 176 1040
WIRE -32 1088 -32 848
WIRE 16 1088 16 1040
WIRE 16 1088 -32 1088
WIRE 768 1088 768 864
WIRE 768 1088 128 1088
WIRE 816 1104 816 832
WIRE 816 1104 128 1104
WIRE 16 1152 16 1088
WIRE 48 1152 16 1152
WIRE 176 1152 176 1040
WIRE 176 1152 144 1152
WIRE 688 1152 688 1008
WIRE -144 1168 -144 960
WIRE 96 1168 96 1152
WIRE 96 1168 -144 1168
FLAG -144 -48 Vd1
IOPIN -144 -48 BiDir
FLAG -208 272 Vddin
IOPIN -208 272 In
FLAG 736 -48 Vd2
IOPIN 736 -48 BiDir
FLAG 688 1152 0
FLAG 1024 -112 Vsw1-
IOPIN 1024 -112 In
FLAG 1024 -80 Vsw1+
IOPIN 1024 -80 In
FLAG 1024 304 Vsw2-
IOPIN 1024 304 In
FLAG 992 816 Vsw3-
IOPIN 992 816 In
FLAG 1024 336 Vsw2+
IOPIN 1024 336 In
FLAG 992 848 Vsw3+
IOPIN 992 848 In
FLAG -192 512 Vpch
IOPIN -192 512 In
SYMBOL nmos4 48 832 R270
SYMATTR InstName M1
SYMATTR Value2 l=2u w=200u ad=1.4e-9 as=1.4e-9 pd=214e-6 ps=214e-6
SYMATTR Value nch
SYMBOL nmos4 144 864 R90
SYMATTR InstName M2
SYMATTR Value2 l=2u w=200u ad=1.4e-9 as=1.4e-9 pd=214e-6 ps=214e-6
SYMATTR Value nch
SYMBOL pmos4 192 336 R270
SYMATTR InstName M3
SYMATTR Value2 l=2u w=150u ad=1.05e-9 as=1.05e-9 pd=164e-6 ps=164e-6
SYMATTR Value pch
SYMBOL pmos4 288 352 R90
SYMATTR InstName M4
SYMATTR Value2 l=2u w=150u ad=1.05e-9 as=1.05e-9 pd=164e-6 ps=164e-6
SYMATTR Value pch
SYMBOL pmos4 336 -80 M90
SYMATTR InstName M7
SYMATTR Value2 l=2u w=150u ad=1.05e-9 as=1.05e-9 pd=164e-6 ps=164e-6
SYMATTR Value pch
SYMBOL pmos4 144 -96 M270
SYMATTR InstName M5
SYMATTR Value2 l=2u w=100u ad=7e-10 as=7e-10 pd=114e-6 ps=114e-6
SYMATTR Value pch
SYMBOL pmos4 48 -64 M90
SYMATTR InstName M6
SYMATTR Value2 l=2u w=100u ad=7e-10 as=7e-10 pd=114e-6 ps=114e-6
SYMATTR Value pch
SYMBOL nmos4 336 -96 R270
SYMATTR InstName M8
SYMATTR Value2 l=2u w=150u ad=1.05e-9 as=1.05e-9 pd=164e-6 ps=164e-6
SYMATTR Value nch
SYMBOL pmos4 464 368 M90
SYMATTR InstName M9
SYMATTR Value2 l=2u w=150u ad=1.05e-9 as=1.05e-9 pd=164e-6 ps=164e-6
SYMATTR Value pch
SYMBOL nmos4 464 336 R270
SYMATTR InstName M10
SYMATTR Value2 l=2u w=150u ad=1.05e-9 as=1.05e-9 pd=164e-6 ps=164e-6
SYMATTR Value nch
SYMBOL pmos4 336 864 M90
SYMATTR InstName M11
SYMATTR Value2 l=2u w=150u ad=1.05e-9 as=1.05e-9 pd=164e-6 ps=164e-6
SYMATTR Value pch
SYMBOL nmos4 336 832 R270
SYMATTR InstName M12
SYMATTR Value2 l=2u w=150u ad=1.05e-9 as=1.05e-9 pd=164e-6 ps=164e-6
SYMATTR Value nch
SYMBOL pmos4 48 160 M90
SYMATTR InstName M13
SYMATTR Value2 l=2u w=10u ad=7e-11 as=7e-11 pd=24u ps=24u
SYMATTR Value pch
SYMBOL nmos4 48 144 R270
SYMATTR InstName M14
SYMATTR Value2 l=2u w=6u ad=4.2e-11 as=4.2e-11 pd=20u ps=20u
SYMATTR Value nch
SYMBOL pmos4 48 608 M90
SYMATTR InstName M15
SYMATTR Value2 l=2u w=10u ad=7e-11 as=7e-11 pd=24u ps=24u
SYMATTR Value pch
SYMBOL nmos4 48 592 R270
SYMATTR InstName M16
SYMATTR Value2 l=2u w=6u ad=4.2e-11 as=4.2e-11 pd=20u ps=20u
SYMATTR Value nch
SYMBOL pmos4 48 1104 M90
SYMATTR InstName M17
SYMATTR Value2 l=2u w=10u ad=7e-11 as=7e-11 pd=24u ps=24u
SYMATTR Value pch
SYMBOL nmos4 48 1088 R270
SYMATTR InstName M18
SYMATTR Value2 l=2u w=6u ad=4.2e-11 as=4.2e-11 pd=20u ps=20u
SYMATTR Value nch

The netlist it stands for:
* ishibeESDkibannew.asc
C102 N015 N014 47p
RVR1 N015 N018 10k
R103 N018 N014 10k
R101 N014 VOUTS 20k
C106 N017 N016 180p
R104 N015 N020 10k
C101 N020 N016 0.47u
R102 N023 N016 1
RVR2 N017 N023 47k
R109 N017 N024 47k
C107 N024 0 0.1u
C109 N013 VINS 0.047u
C105 N021 0 100u
C110 N021 0 0.1u
C108 N019 0 100u
C111 N019 0 0.1u
C104 N022 0 470u
C103 N022 0 0.1u
R301 N001 VDDK 47k
R302 N002 VDDK 47k
R303 N003 VDDK 47k
R304 N004 VDDK 47k
R305 N005 VDDK 47k
R306 N006 VDDK 47k
S1 N001 0 N012 0 DSW
S2 N002 0 N011 0 DSW
S3 N003 0 N010 0 DSW
S4 N004 0 N009 0 DSW
S5 N005 0 N008 0 DSW
S6 N006 0 N007 0 DSW
V1 N012 0 -1
V2 N011 0 5
V3 N010 0 -1
V4 N009 0 -1
V5 N008 0 -1
V6 N007 0 -1
V7 VDDK 0 5
V8 VINS 0 SINE(0 0.5 1k)
R1 N013 N022 470k
V9 Vbg2cont 0 5
XX1 N001 N002 N003 N004 N005 N006 VDDK N013 N017 Vbg2cont Vbg2cont N019 N021 N015 VOUTS N022 N014 N016 N014 effectornew

* block symbol definitions
.subckt effectornew Dsw1 Dsw2 Dsw3 Dsw4 Dsw5 Dsw6 VDD Vinop1+ Vinop1- Vb2cont Vb1cont Vbiasop1 Vbiasop2 Vind1 Vinoutd2 VN Voutd1 Voutop1 Voutop2
R5 VN VDD 10k
R6 0 VN 10k
XX2 Dsw2 VDD N003 N004 invsw
XX3 Dsw1 VDD N001 N002 invsw
XX4 Dsw3 VDD N005 N006 invsw
R7 Vbiasop2 VDD 40k
XX5 Dsw5 VDD N009 N010 invsw
XX6 Dsw4 VDD N007 N008 invsw
XX7 Dsw6 VDD N011 N012 invsw
R10 Vbiasop1 VDD 40k
XX1 Vinop1- Vinop1+ Voutop1 VDD Vbiasop1 opamp3u
XX10 Vind1 VN Voutop2 VDD Vbiasop2 opamp3u
XX8 VDD N002 N001 N004 N003 N006 N005 Vind1 Voutd1 Vb1cont distotiondevice1esdpchnew
XX9 VDD N008 N007 N010 N009 N012 N011 VN Vinoutd2 Vb2cont distotiondevice1esdpchnew
* .tran 10m
* .include 'mos_tt.lib'
.ends effectornew

.subckt invsw VINinv VDDinv Vo- Vo+
M1 Vo- VINinv 0 0 nch l=2u w=6u ad=4.2e-11 as=4.2e-11 pd=20e-6 ps=20e-6
M2 VDDinv VINinv Vo- VDDinv pch l=2u w=10u ad=7e-11 as=7e-11 pd=24e-6 ps=24e-6
M3 Vo+ Vo- 0 0 nch l=2u w=12u ad=8.4e-11 as=8.4e-11 pd=26e-6 ps=26e-6
M4 VDDinv Vo- Vo+ VDDinv pch l=2u w=20u ad=1.4e-10 as=1.4e-10 pd=34e-6 ps=34e-6
* .tran 10m
* .include 'mos_tt.lib'
.ends invsw

.subckt opamp3u Vin- Vin+ Vout VDD Vbias
M1 VDD N001 N002 VDD pch l=3u w=150u ad=1.05e-9 as=1.05e-9 pd=164e-6 ps=164e-6
M2 VDD N001 Vout VDD pch l=3u w=150u ad=1.05e-9 as=1.05e-9 pd=164e-6 ps=164e-6 m=2
M3 N002 Vin- N004 N002 pch l=3u w=75u ad=5.25e-10 as=5.25e-10 pd=89e-6 ps=89e-6
M4 N002 N003 N003 N002 pch l=2u w=75u ad=5.25e-10 as=5.25e-10 pd=89e-6 ps=89e-6
M5 VDD N001 N001 VDD pch l=3u w=150u ad=1.05e-9 as=1.05e-9 pd=164e-6 ps=164e-6
M6 N002 Vin+ N005 N002 pch l=3u w=75u ad=5.25e-10 as=5.25e-10 pd=89e-6 ps=89e-6
M7 N005 N006 N007 N005 pch l=4u w=75u ad=5.25e-10 as=5.25e-10 pd=89e-6 ps=89e-6
M8 N004 N006 N008 N004 pch l=4u w=75u ad=5.25e-10 as=5.25e-10 pd=89e-6 ps=89e-6
M9 N007 N008 N011 0 nch l=3u w=50u ad=3.5e-10 as=3.5e-10 pd=64e-6 ps=64e-6
M10 N011 N010 0 0 nch l=3u w=50u ad=3.5e-10 as=3.5e-10 pd=64e-6 ps=64e-6
M11 N008 N008 N010 0 nch l=3u w=50u ad=3.5e-10 as=3.5e-10 pd=64e-6 ps=64e-6
M12 N010 N010 0 0 nch l=3u w=50u ad=3.5e-10 as=3.5e-10 pd=64e-6 ps=64e-6
M13 VDD N007 N009 0 nch l=3u w=50u ad=3.5e-10 as=3.5e-10 pd=64e-6 ps=64e-6
M14 N009 N010 0 0 nch l=3u w=50u ad=3.5e-10 as=3.5e-10 pd=64e-6 ps=64e-6
M15 Vout N009 0 0 nch l=3u w=300u ad=2.1e-9 as=2.1e-9 pd=314e-6 ps=314e-6
C1 N007 Vout 3p
M16 N006 Vbias 0 0 nch l=3u w=50u ad=3.5e-10 as=3.5e-10 pd=64e-6 ps=64e-6
M17 N001 Vbias 0 0 nch l=3u w=100u ad=7e-10 as=7e-10 pd=114e-6 ps=114e-6
M18 Vbias Vbias 0 0 nch l=3u w=100u ad=7e-10 as=7e-10 pd=114e-6 ps=114e-6
M19 N003 N006 N006 N003 pch l=2u w=75u ad=5.25e-10 as=5.25e-10 pd=89e-6 ps=89e-6
* .ac dec 10 1 100meg
* .lib 'mos_tt.lib'
* ;op
* ;ac dec 10 10 100meg
* .tf v(Vout) Vin+
* .step param L 2u 10u 0.2u
.ends opamp3u

.subckt distotiondevice1esdpchnew Vddin Vsw1+ Vsw1- Vsw2+ Vsw2- Vsw3+ Vsw3- Vd1 Vd2 Vpch
M1 Vd1 Vd1 N003 0 nch l=2u w=200u ad=1.4e-9 as=1.4e-9 pd=214e-6 ps=214e-6
M2 N003 N003 Vd1 0 nch l=2u w=200u ad=1.4e-9 as=1.4e-9 pd=214e-6 ps=214e-6
M3 Vd1 N002 N002 Vpch pch l=2u w=150u ad=1.05e-9 as=1.05e-9 pd=164e-6 ps=164e-6
M4 N002 Vd1 Vd1 Vpch pch l=2u w=150u ad=1.05e-9 as=1.05e-9 pd=164e-6 ps=164e-6
M7 N001 Vsw1+ Vd2 Vddin pch l=2u w=150u ad=1.05e-9 as=1.05e-9 pd=164e-6 ps=164e-6
M5 N001 N001 Vd1 N001 pch l=2u w=100u ad=7e-10 as=7e-10 pd=114e-6 ps=114e-6
M6 Vd1 Vd1 N001 Vd1 pch l=2u w=100u ad=7e-10 as=7e-10 pd=114e-6 ps=114e-6
M8 N001 Vsw1- Vd2 0 nch l=2u w=150u ad=1.05e-9 as=1.05e-9 pd=164e-6 ps=164e-6
M9 N002 Vsw2+ Vd2 Vddin pch l=2u w=150u ad=1.05e-9 as=1.05e-9 pd=164e-6 ps=164e-6
M10 N002 Vsw2- Vd2 0 nch l=2u w=150u ad=1.05e-9 as=1.05e-9 pd=164e-6 ps=164e-6
M11 N003 Vsw3+ Vd2 Vddin pch l=2u w=150u ad=1.05e-9 as=1.05e-9 pd=164e-6 ps=164e-6
M12 N003 Vsw3- Vd2 0 nch l=2u w=150u ad=1.05e-9 as=1.05e-9 pd=164e-6 ps=164e-6
M13 Vd1 Vsw1- N001 Vddin pch l=2u w=10u ad=7e-11 as=7e-11 pd=24u ps=24u
M14 Vd1 Vsw1+ N001 0 nch l=2u w=6u ad=4.2e-11 as=4.2e-11 pd=20u ps=20u
M15 Vd1 Vsw2- N002 Vddin pch l=2u w=10u ad=7e-11 as=7e-11 pd=24u ps=24u
M16 Vd1 Vsw2+ N002 0 nch l=2u w=6u ad=4.2e-11 as=4.2e-11 pd=20u ps=20u
M17 Vd1 Vsw3- N003 Vddin pch l=2u w=10u ad=7e-11 as=7e-11 pd=24u ps=24u
M18 Vd1 Vsw3+ N003 0 nch l=2u w=6u ad=4.2e-11 as=4.2e-11 pd=20u ps=20u
.ends distotiondevice1esdpchnew

.model NMOS NMOS
.model PMOS PMOS
.lib standard.mos
.include 'mos_tt.lib'
.tran 10m
.model DSW SW(Ron=0.01 Roff=100meg)
.backanno
.end